# Altium schematic sheet Power.SchDoc: =ProjectName
size A4; CheckedBy: DatNB; Author: Ven; CompanyName: Nacentech; Organization: IMET
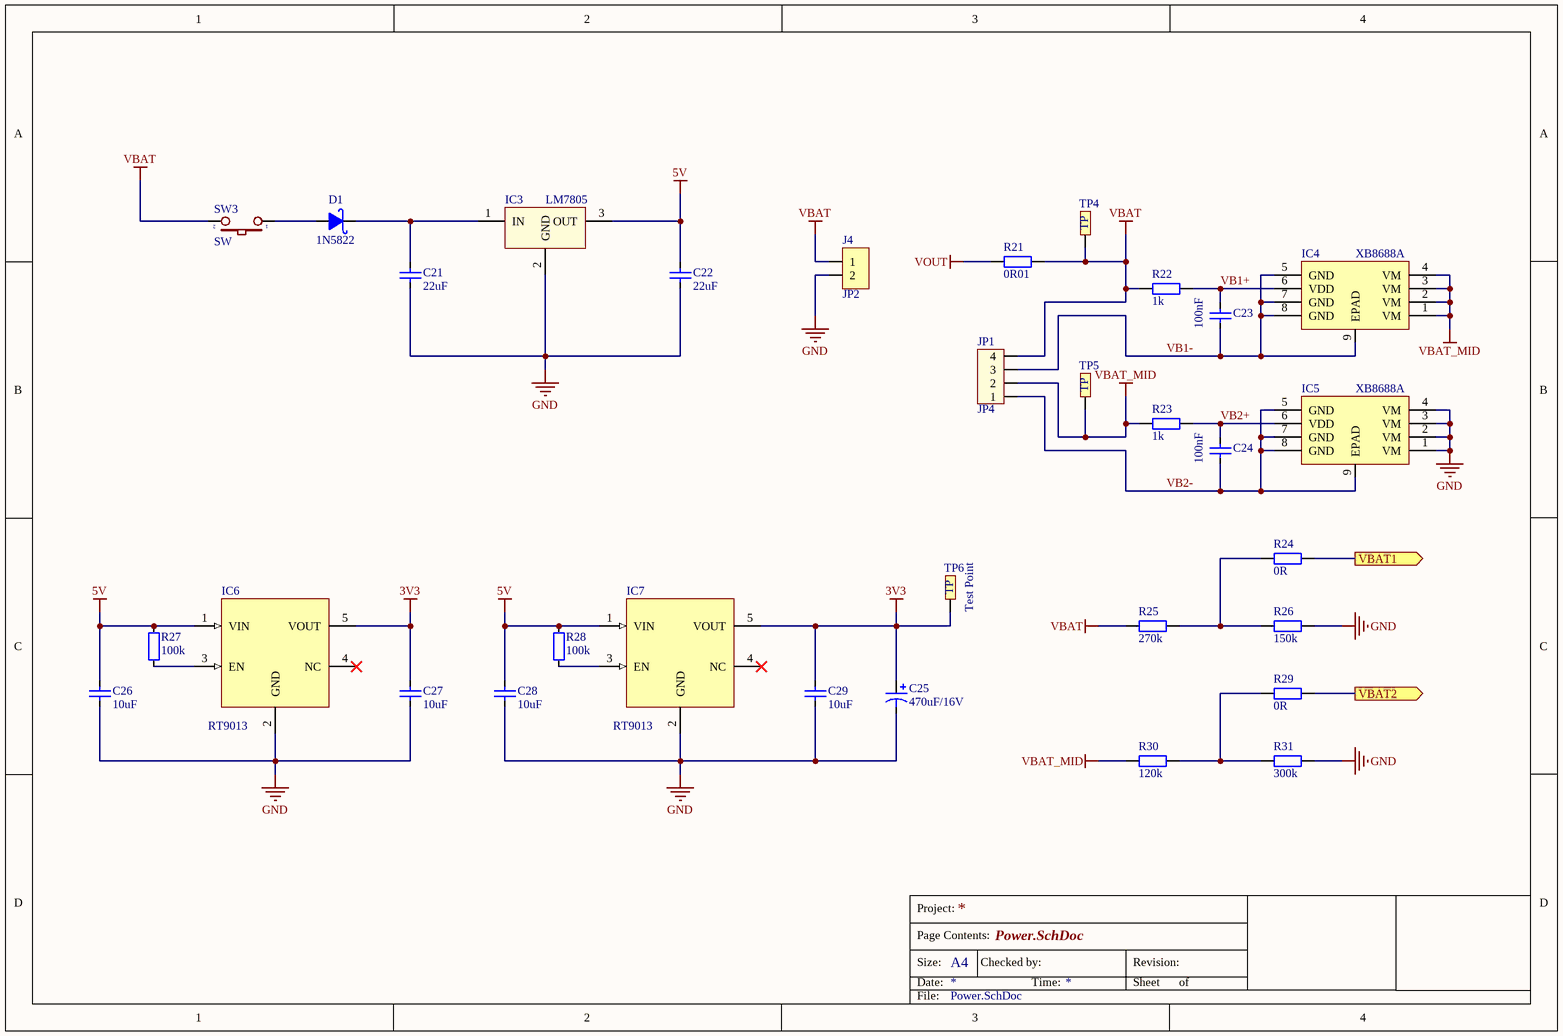
[diagram p0: Power.SchDoc]

## Parts
C21  22uF  [CAP_0805]
C22  22uF  [CAP_0805]
C23  100nF  [CAP_0805]
C24  100nF  [CAP_0805]
C25  470uF/16V  [C8mm]
C26  10uF  [CAP_0805]
C27  10uF  [CAP_0805]
C28  10uF  [CAP_0805]
C29  10uF  [CAP_0805]
D1  1N5822  [DIO-214AC(SMA)]
IC3  LM7805  [TO-252]
IC4  XB8688A  [SOP8-PP]
IC5  XB8688A  [SOP8-PP]
IC6  RT9013  [SOT23-5]
IC7  RT9013  [SOT23-5]
J4  JP2  [JP2-D1T]
JP1  JP4  [CON4]
R21  0R01  [RES-SMD-2512]
R22  1k  [RES-SMD-0805]
R23  1k  [RES-SMD-0805]
R24  0R  [RES-SMD-0805]
R25  270k  [RES-SMD-0805]
R26  150k  [RES-SMD-0805]
R27  100k  [RES-SMD-0805]
R28  100k  [RES-SMD-0805]
R29  0R  [RES-SMD-0805]
R30  120k  [RES-SMD-0805]
R31  300k  [RES-SMD-0805]
SW3  SW  [SW102]
TP4  Test Point  [TP_SMD]  (value not drawn)
TP5  Test Point  [TP_SMD]  (value not drawn)
TP6  Test Point  [TP_SMD]

## Ports
VBAT1 (out), VBAT2 (out)

## Nets
3V3: C25.1 C27.2 C29.2 IC6.5(VOUT) IC7.5(VOUT) TP6.1
5V: C22.2 C26.2 C28.2 IC3.3(OUT) IC6.1(VIN) IC7.1(VIN) R27.1 R28.1
GND: C21.1 C22.1 C25.2 C26.1 C27.1 C28.1 C29.1 IC3.2(GND) IC5.1(VM) IC5.2(VM) IC5.3(VM) IC5.4(VM) IC6.2(GND) IC7.2(GND) J4.2 R26.1 R31.1
VBAT: J4.1 JP1.4 R21.2 R22.2 R25.2 SW3.2 TP4.1
VBAT_MID: IC4.1(VM) IC4.2(VM) IC4.3(VM) IC4.4(VM) JP1.2 R23.2 R30.2 TP5.1
VOUT: R21.1
VB1+: C23.2 IC4.6(VDD) R22.1
VB1-: C23.1 IC4.5(GND) IC4.7(GND) IC4.8(GND) IC4.9(EPAD) JP1.3
VB2+: C24.2 IC5.6(VDD) R23.1
VB2-: C24.1 IC5.5(GND) IC5.7(GND) IC5.8(GND) IC5.9(EPAD) JP1.1
VBAT1: R24.1 ; port VBAT1
VBAT2: R29.1 ; port VBAT2
NetC21_2: C21.2 D1.2(K) IC3.1(IN)
NetD1_1: D1.1(A) SW3.1
NetIC6_3: IC6.3(EN) R27.2
NetIC7_3: IC7.3(EN) R28.2
NetR24_2: R24.2 R25.1 R26.2
NetR29_2: R29.2 R30.1 R31.2

Not connected (* = marked no-connect by the designer): IC6 4(NC)*; IC7 4(NC)*

## Notes on the sheet
- Project:
- Page Contents:
- Size:
- Date:
- A4
- Checked by:
- Time:
- Revision:
- Sheet
- of
- File:

## Library data of the parts
C21-C24 C26-C29 = CapSMD: Capacitor; Value: 33p; Published: 8-Jun-2000; LatestRevisionDate: 17-Jul-2002; LatestRevisionNote: Re-released for DXP Platform.; PackageReference: RAD-0.3; Publisher: Altium Limited
C25 = Cap Pol: Polarized Capacitor (Axial); Published: 8-Jun-2000; LatestRevisionDate: 17-Jul-2002; LatestRevisionNote: Re-released for DXP Platform.; PackageReference: POLAR0.8; Publisher: Altium Limited
D1 = 1N5822: Schottky Rectifiers; Value: Diode c?m 1N5408
IC3 = LM78xx: LDO to 5V; Value: LM7805
IC4 IC5 = XB8688: One Cell Lithium-ion/Polymer Battery Protection IC
IC6 IC7 = RT9013: RT9013-33GB IC REG LINEAR 3.3V 500mA SOT23-5
J4 = JP2: WR-PHD 2.54 mm Angled Socket Header; Manufacturer: W¨¹rth Elektronik eiSos GmbH; partNo: 613002143121; ComponentLink1 Description: Manufacturer; ComponentLink2 Description: Datasheet; NoPins: 02; Created Date: 29 March 2013; ComponentLink1URL: http://www.we-online.com; ComponentLink2URL: http://katalog.we-online.de/em/datasheet/6130xx143121.pdf; Created by: Karrer Zheng
JP1 = Con4: Connector 4; Value: Connector 4
R21-R26 R29-R31 = Resistor - SMD: Resistor SMD; Manufacturer: Generic Components; Class: Passive; Published: 08/06/2000; Publisher: Altium Hobart Technology Centre
R27 R28 = Resistor - SMD: Resistor; Manufacturer: Generic Components; Class: Passive; Published: 08/06/2000; Publisher: Altium Hobart Technology Centre
SW3 = SW2: Switch button 2 pin; Value: SW chip 2 pin
TP4-TP6 = TP: CONNECT 1